# Altium project Gas Analyser O2 CO2.PrjPcb
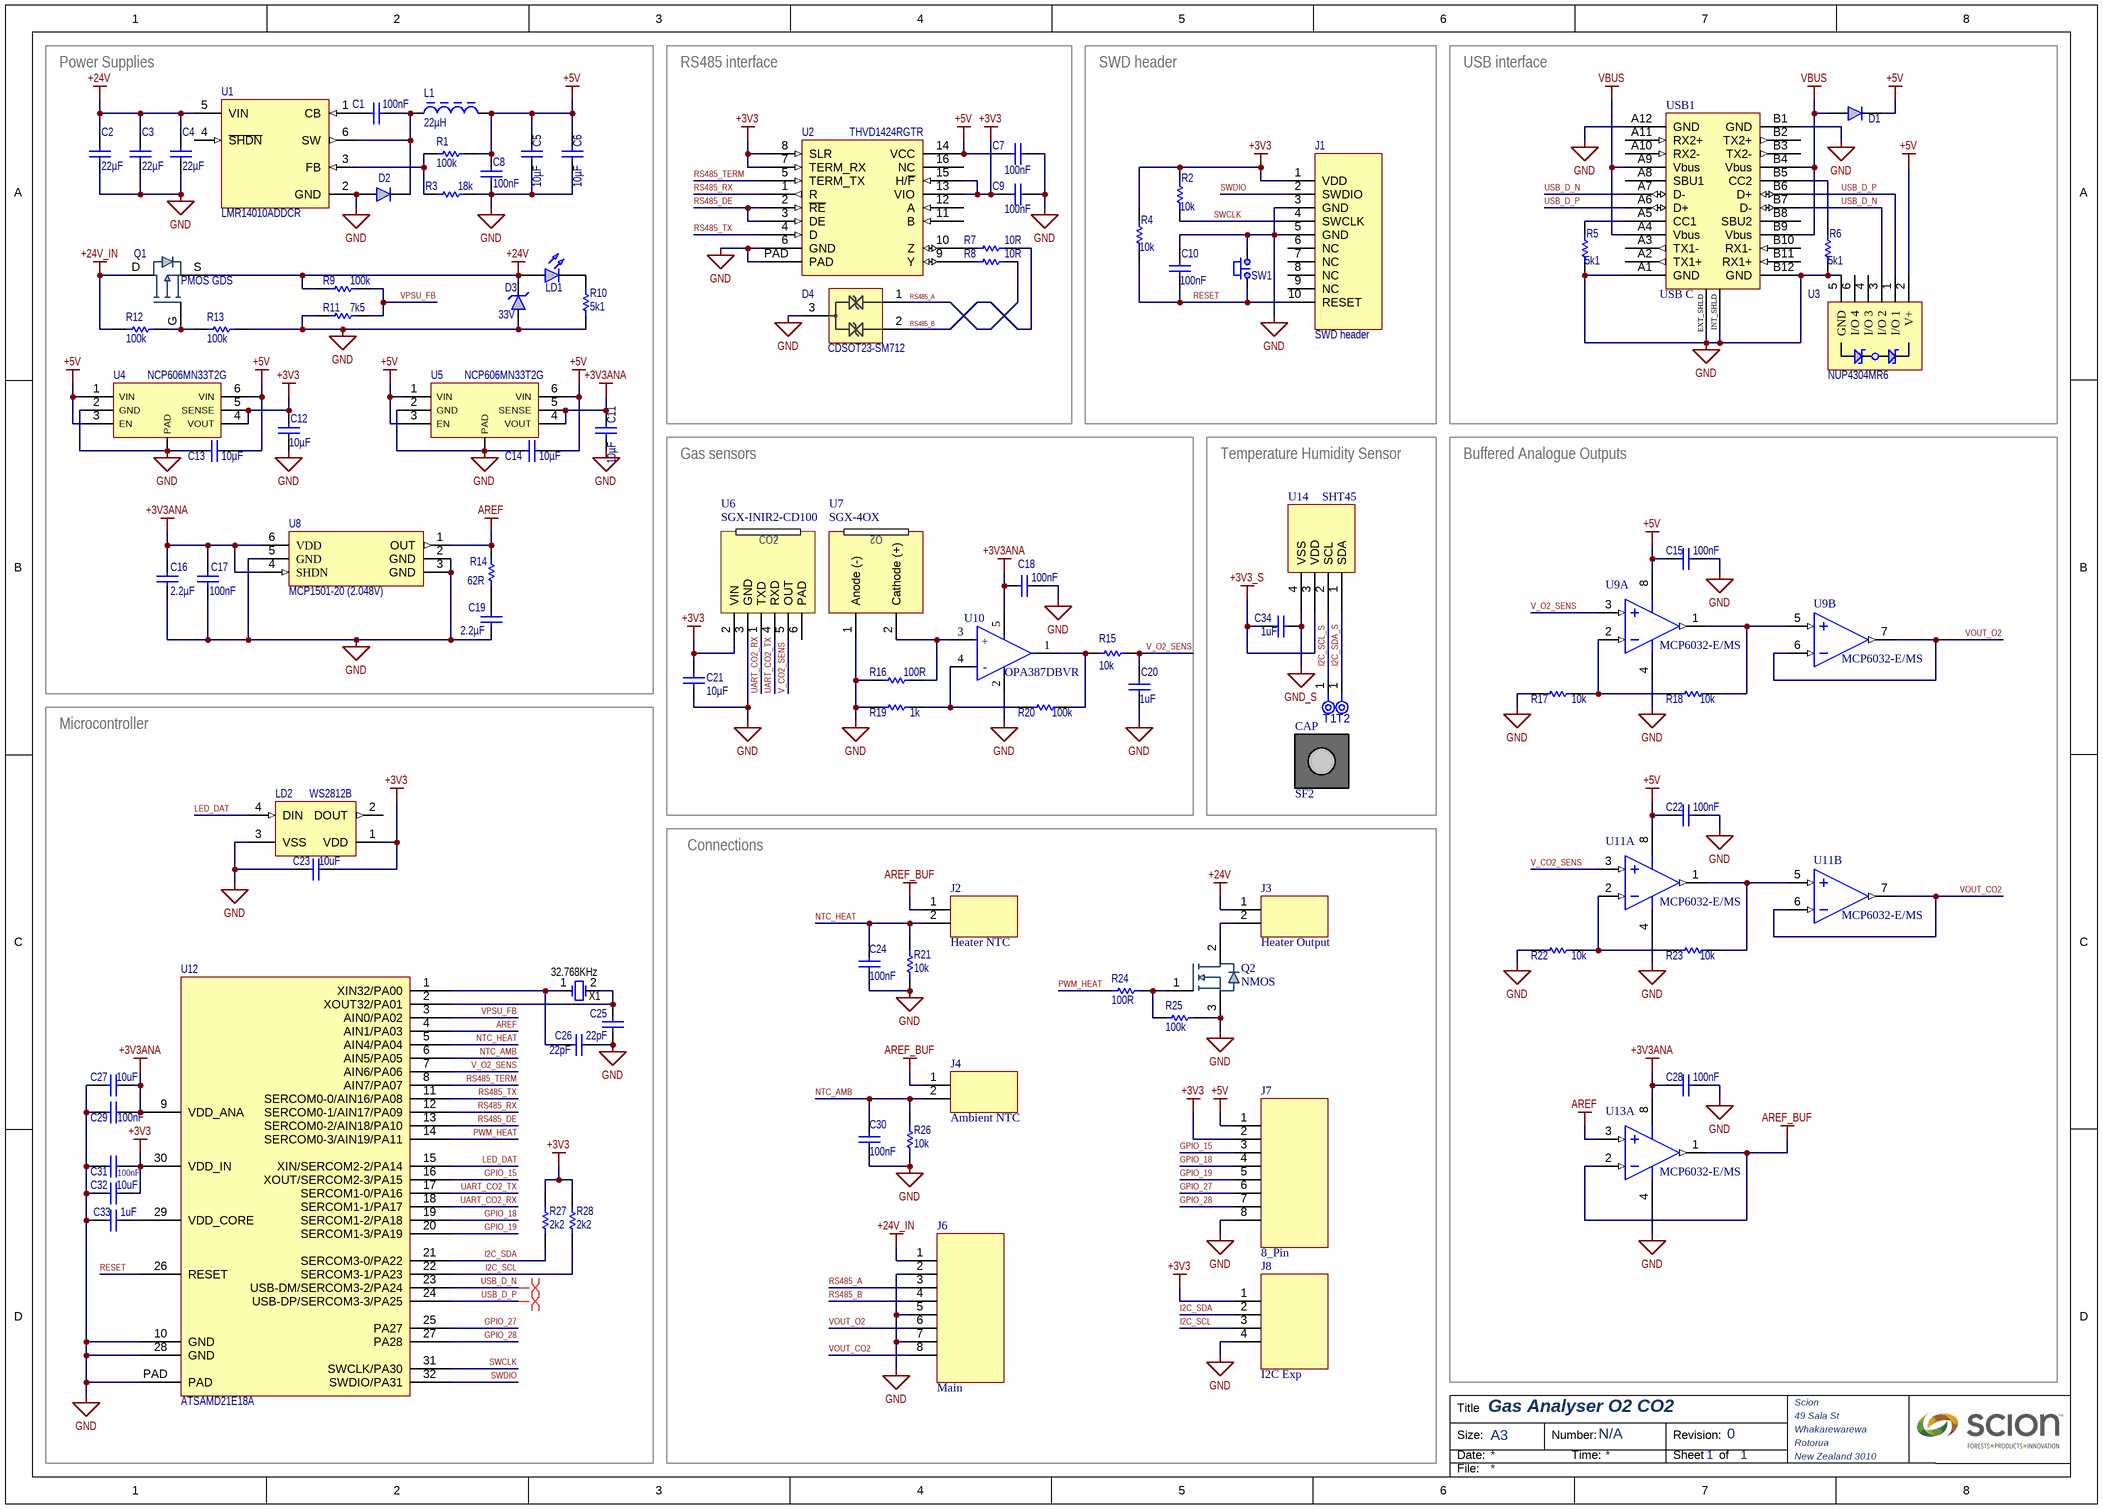
[diagram p0: Gas Analyser O2 CO2.SchDoc]
1 sheet, 98 parts. Net scope: global (net labels, ports and power ports of the same name join across sheets).
Board files: Gas Analyser O2 CO2 - No SHT45 Board.PcbDoc, Gas Analyser O2 CO2.PcbDoc

## Sheet Gas Analyser O2 CO2.SchDoc: Gas Analyser O2 CO2
size A3; Author: Peake J; CompanyName: Scion Research; DrawnBy: Peake J; Engineer: Peake J; Organization: Scion; Address1: 49 Sala St; Address2: Whakarewarewa; Address3: Rotorua; Address4: New Zealand 3010; DocumentNumber: N/A; Revision: 0; SheetNumber: 1; SheetTotal: 1

### Parts
C1  value 100nF  [0603_CAP]  (hidden comment: Capacitor)
C2  value 22µF  [1206_CAP]  (hidden comment: Capacitor)
C3  value 22µF  [1206_CAP]  (hidden comment: Capacitor)
C4  value 22µF  [1206_CAP]  (hidden comment: Capacitor)
C5  value 10µF  [0603_CAP]  (hidden comment: Capacitor)
C6  value 10µF  [0603_CAP]  (hidden comment: Capacitor)
C7  value 100nF  [0603_CAP]  (hidden comment: Capacitor)
C8  value 100nF  [0603_CAP]  (hidden comment: Capacitor)
C9  value 100nF  [0603_CAP]  (hidden comment: Capacitor)
C10  value 100nF  [0603_CAP]  (hidden comment: Capacitor)
C11  value 10µF  [0603_CAP]  (hidden comment: Capacitor)
C12  value 10µF  [0603_CAP]  (hidden comment: Capacitor)
C13  value 10µF  [0603_CAP]  (hidden comment: Capacitor)
C14  value 10µF  [0603_CAP]  (hidden comment: Capacitor)
C15  value 100nF  [0603_CAP]  (hidden comment: Capacitor)
C16  value 2.2µF  [0603_CAP]  (hidden comment: Capacitor)
C17  value 100nF  [0603_CAP]  (hidden comment: Capacitor)
C18  value 100nF  [0603_CAP]  (hidden comment: Capacitor)
C19  value 2.2µF  [0603_CAP]  (hidden comment: Capacitor)
C20  value 1uF  [0603_CAP]  (hidden comment: Capacitor)
C21  value 10µF  [0603_CAP]  (hidden comment: Capacitor)
C22  value 100nF  [0603_CAP]  (hidden comment: Capacitor)
C23  value 10uF  [0603_CAP]  (hidden comment: Capacitor)
C24  value 100nF  [0603_CAP]  (hidden comment: Capacitor)
C25  value 22pF  [0402_CAP]  (hidden comment: Capacitor)
C26  value 22pF  [0402_CAP]  (hidden comment: Capacitor)
C27  value 10uF  [0603_CAP]  (hidden comment: Capacitor)
C28  value 100nF  [0603_CAP]  (hidden comment: Capacitor)
C29  value 100nF  [0402_CAP]  (hidden comment: Capacitor)
C30  value 100nF  [0603_CAP]  (hidden comment: Capacitor)
C31  value 100nF  [0402_CAP]  (hidden comment: Capacitor)
C32  value 10uF  [0603_CAP]  (hidden comment: Capacitor)
C33  value 1uF  [0402_CAP]  (hidden comment: Capacitor)
C34  value 1uF  [0603_CAP]  (hidden comment: Capacitor)
CAP  SF2  [SF2-Footprint-1]
D1  Diode  [SOD-123]  (value not drawn)
D2  Diode  [SOD-123]  (value not drawn)
D3  Rated Voltage: 33V  [SMBJ]  (hidden comment: Transil)
D4  CDSOT23-SM712  [FP-SOT23-IPC_C]
J1  SWD header  [DIP10_1.27_M_SMD]
J2  Heater NTC  [2mm RA S2B-PH-K-S]
J3  Heater Output  [2mm RA S2B-PH-K-S]
J4  Ambient NTC  [2mm RA S2B-PH-K-S]
J6  Main  [8P RA MOLEX Clik-MATE 1.5mm]
J7  8_Pin  [8P DIP Male Header 2.54mm]
J8  I2C Exp  [4P RA MOLEX Clik-MATE 1.5mm]
L1  value 22µH  [BOUR-SRN8040_V]  (hidden comment: Inductor)
LD1  LED  [0805]  (value not drawn)
LD2  WS2812B  [WS2812B-2020]
Q1  PMOS GDS  [PowerDI 5060-8]
Q2  NMOS  [SOT-23]
R1  value 100k  [0603_RES]  (hidden comment: Resistor)
R2  value 10k  [0603_RES]  (hidden comment: Resistor)
R3  value 18k  [0603_RES]  (hidden comment: Resistor)
R4  value 10k  [0603_RES]  (hidden comment: Resistor)
R5  value 5k1  [0603_RES]  (hidden comment: Resistor)
R6  value 5k1  [0603_RES]  (hidden comment: Resistor)
R7  value 10R  [0603_RES]  (hidden comment: Resistor)
R8  value 10R  [0603_RES]  (hidden comment: Resistor)
R9  value 100k  [0603_RES]  (hidden comment: Resistor)
R10  value 5k1  [0603_RES]  (hidden comment: Resistor)
R11  value 7k5  [0603_RES]  (hidden comment: Resistor)
R12  value 100k  [0603_RES]  (hidden comment: Resistor)
R13  value 100k  [0603_RES]  (hidden comment: Resistor)
R14  value 62R  [0603_RES]  (hidden comment: Resistor)
R15  value 10k  [0603_RES]  (hidden comment: Resistor)
R16  value 100R  [0603_RES]  (hidden comment: Resistor)
R17  value 10k  [0603_RES]  (hidden comment: Resistor)
R18  value 10k  [0603_RES]  (hidden comment: Resistor)
R19  value 1k  [0603_RES]  (hidden comment: Resistor)
R20  value 100k  [0603_RES]  (hidden comment: Resistor)
R21  value 10k  [0603_RES]  (hidden comment: Resistor)
R22  value 10k  [0603_RES]  (hidden comment: Resistor)
R23  value 10k  [0603_RES]  (hidden comment: Resistor)
R24  value 100R  [0603_RES]  (hidden comment: Resistor)
R25  value 100k  [0603_RES]  (hidden comment: Resistor)
R26  value 10k  [0603_RES]  (hidden comment: Resistor)
R27  value 2k2  [0603_RES]  (hidden comment: Resistor)
R28  value 2k2  [0603_RES]  (hidden comment: Resistor)
SW1  EVP-AAN02Q  [FP-EVP-AAN02Q-MFG]  (value not drawn)
T1  Test Point  [TP06R]  (value not drawn)  (no BOM)
T2  Test Point  [TP06R]  (value not drawn)  (no BOM)
U1  LMR14010ADDCR  [FP-DDC0006A-IPC_A]
U2  THVD1424RGTR  [QFN50P300X300X100_HS-17N]
U3  NUP4304MR6  [TSOP-6]
U4  NCP606MN33T2G  [QFN95P330X295X100_HS-7N]
U5  NCP606MN33T2G  [QFN95P330X295X100_HS-7N]
U6  SGX-INIR2-CD100  [SGX-INIR2-CD100-Footprint-1]
U7  SGX-4OX  [SGX-4OX-Footprint-1]
U8  MCP1501-20 (2.048V)  [SOT-6]
U9  MCP6032-E/MS  [MSOP-MS8_M]  (parts A,B of 2)
U10  OPA387DBVR  [FP-DBV0005A-IPC_A]
U11  MCP6032-E/MS  [MSOP-MS8_M]  (parts A,B of 2)
U12  ATSAMD21E18A  [32P QFN]
U13  MCP6032-E/MS  [MSOP-MS8_M]  (part A of 2)
U14  SHT45  [SHT45-AD1B-R3-Footprint-1]
USB1  USB C  [GT-USB-7010ASV]
X1  32.768KHz  [ABRA-ABS07-2_V]

### Blocks framed on the sheet
Power Supplies: C1-C6 C8 C11-C14 C16 C17 C19 D2 D3 L1 LD1 Q1 R1 R3 R9-R14 U1 U4 U5 U8
RS485 interface: C7 C9 D4 R7 R8 U2
SWD header: C10 J1 R2 R4 SW1
USB interface: D1 R5 R6 U3 USB1
Gas sensors: C18 C20 C21 R15 R16 R19 R20 U6 U7 U10
Temperature Humidity Sensor: C34 CAP T1 T2 U14
Buffered Analogue Outputs: C15 C22 C28 R17 R18 R22 R23 U9 U11 U13
Microcontroller: C23 C25-C27 C29 C31-C33 LD2 R27 R28 U12 X1
Connections: C24 C30 J2-J4 J6-J8 Q2 R21 R24-R26

### Nets
+3V3: C9.2 C12.1 C21.1 C23.1 C31.1 C32.1 J1.1(VDD) J7.2 J8.1 LD2.1(VDD) R2.1 R4.1 R27.2 R28.2 U2.7(TERM_RX) U2.8(SLR) U2.13(VIO) U2.15(H/~{F}) U4.4(VOUT) U4.5(SENSE) U6.2(VIN) U12.30(VDD_IN)
+3V3_S: C34.2 U14.3(VDD)
+3V3ANA: C11.1 C16.1 C17.1 C18.1 C27.1 C28.1 C29.1 U5.4(VOUT) U5.5(SENSE) U8.4(SHDN) U8.6(VDD) U10.5(V+) U12.9(VDD_ANA) U13.8(V+)
+5V: C5.1 C6.1 C7.2 C8.1 C13.1 C14.1 C15.1 C22.1 D1.1(K) J7.1 L1.2 R1.2 U2.14(VCC) U3.2(V+) U4.1(VIN) U4.3(EN) U4.6(VIN) U5.1(VIN) U5.3(EN) U5.6(VIN) U9.8(V+) U11.8(V+)
+24V: C2.1 C3.1 C4.1 D3.2(K) J3.1(+) LD1.2(A) Q1.S R9.1 U1.5(VIN)
+24V_IN: J6.1 Q1.D R12.1
AREF: R14.1 U8.1(OUT) U12.4(AIN1/PA03) U13.3(VINA+)
AREF_BUF: J2.1(+) J4.1(+) U13.1(VOUTA) U13.2(VINA-)
GND: C2.2 C3.2 C4.2 C5.2 C6.2 C7.1 C8.2 C9.1 C10.1 C11.2 C12.2 C13.2 C14.2 C15.2 C16.2 C17.2 C18.2 C19.1 C20.2 C21.2 C22.2 C23.2 C24.1 C25.2 C26.1 C27.2 C28.2 C29.2 C30.1 C31.2 C32.2 C33.2 D2.2(A) D3.1(A) D4.3 J1.3(GND) J1.5(GND) J6.2 J6.5 J6.7 J7.8 J8.4 LD2.3(VSS) Q2.3(S) R3.2 R5.2 R6.2 R10.2 R11.1 R13.2 R16.1 R17.2 R19.2 R21.1 R22.2 R25.1 R26.1 SW1.2 U1.2(GND) U2.6(GND) U2.PAD U3.5(GND) U4.2(GND) U4.PAD U5.2(GND) U5.PAD U6.3(GND) U7.1(Anode_(-)) U8.2(GND) U8.3(GND) U8.5(GND) U9.4(V-) U10.2(V-) U11.4(V-) U12.10(GND) U12.28(GND) U12.PAD U13.4(V-) USB1.A1(GND) USB1.A12(GND) USB1.B1(GND) USB1.B12(GND) USB1.EXT_SHLD USB1.INT_SHLD
GND_S: C34.1 U14.4(VSS)
VBUS: D1.2(A) USB1.A4(Vbus) USB1.A9(Vbus) USB1.B4(Vbus) USB1.B9(Vbus)
GPIO_15: J7.3 U12.16(XOUT/SERCOM2-3/PA15)
GPIO_18: J7.4 U12.19(SERCOM1-2/PA18)
GPIO_19: J7.5 U12.20(SERCOM1-3/PA19)
GPIO_27: J7.6 U12.25(PA27)
GPIO_28: J7.7 U12.27(PA28)
I2C_SCL: J8.3 R28.1 U12.22(SERCOM3-1/PA23)
I2C_SCL_S: T1.1(TP) U14.2(SCL)
I2C_SDA: J8.2 R27.1 U12.21(SERCOM3-0/PA22)
I2C_SDA_S: T2.1(TP) U14.1(SDA)
LED_DAT: LD2.4(DIN) U12.15(XIN/SERCOM2-2/PA14)
NTC_AMB: C30.2 J4.2(-) R26.2 U12.6(AIN5/PA05)
NTC_HEAT: C24.2 J2.2(-) R21.2 U12.5(AIN4/PA04)
PWM_HEAT: R24.2 U12.14(SERCOM0-3/AIN19/PA11)
RESET: C10.2 J1.10(RESET) R4.2 SW1.1 U12.26(RESET)
RS485_A: D4.1 J6.3 R8.1
RS485_B: D4.2 J6.4 R7.2
RS485_DE: U2.2(~{RE}) U2.3(DE) U12.13(SERCOM0-2/AIN18/PA10)
RS485_RX: U2.1(R) U12.12(SERCOM0-1/AIN17/PA09)
RS485_TERM: U2.5(TERM_TX) U12.8(AIN7/PA07)
RS485_TX: U2.4(D) U12.11(SERCOM0-0/AIN16/PA08)
SWCLK: J1.4(SWCLK) R2.2 U12.31(SWCLK/PA30)
SWDIO: J1.2(SWDIO) U12.32(SWDIO/PA31)
UART_CO2_RX: U6.1(TXD) U12.18(SERCOM1-1/PA17)
UART_CO2_TX: U6.4(RXD) U12.17(SERCOM1-0/PA16)
USB_D_N: U3.3(I/O_2) U12.23(USB-DM/SERCOM3-2/PA24) USB1.A7(D-) USB1.B7(D-)
USB_D_P: U3.1(I/O_1) U12.24(USB-DP/SERCOM3-3/PA25) USB1.A6(D+) USB1.B6(D+)
V_CO2_SENS: U6.5(OUT) U11.3(VINA+)
V_O2_SENS: C20.1 R15.2 U9.3(VINA+) U12.7(AIN6/PA06)
VOUT_CO2: J6.8 U11.6(VINB-) U11.7(VOUTB)
VOUT_O2: J6.6 U9.6(VINB-) U9.7(VOUTB)
VPSU_FB: R9.2 R11.2 U12.3(AIN0/PA02)
NetC1_1: C1.1 D2.1(K) L1.1 U1.6(SW)
NetC1_2: C1.2 U1.1(CB)
NetC19_2: C19.2 R14.2
NetC25_1: C25.1 U12.2(XOUT32/PA01) X1.2(OSC2)
NetC26_2: C26.2 U12.1(XIN32/PA00) X1.1(OSC1)
NetC33_1: C33.1 U12.29(VDD_CORE)
NetJ3_2: J3.2(-) Q2.2(D)
NetLD1_1: LD1.1(K) R10.1
NetQ1_G: Q1.G R12.2 R13.1
NetQ2_1: Q2.1(G) R24.1 R25.2
NetR1_1: R1.1 R3.1 U1.3(FB)
NetR5_1: R5.1 USB1.A5(CC1)
NetR6_1: R6.1 USB1.B5(CC2)
NetR7_1: R7.1 U2.10(Z)
NetR8_2: R8.2 U2.9(Y)
NetR15_1: R15.1 R20.2 U10.1(OUT)
NetR16_2: R16.2 U7.2(Cathode_(+)) U10.3(+IN)
NetR17_1: R17.1 R18.1 U9.2(VINA-)
NetR18_2: R18.2 U9.1(VOUTA) U9.5(VINB+)
NetR19_1: R19.1 R20.1 U10.4(-IN)
NetR22_1: R22.1 R23.1 U11.2(VINA-)
NetR23_2: R23.2 U11.1(VOUTA) U11.5(VINB+)

Not connected (* = marked no-connect by the designer): J1 6(NC) 7(NC) 8(NC) 9(NC); LD2 2(DOUT); U1 4(~{SHDN}); U2 11(B) 12(A) 16(NC); U3 4(I/O_3) 6(I/O_4); U6 6(PAD); USB1 A2(TX1+) A3(TX1-) A8(SBU1) A10(RX2-) A11(RX2+) B2(TX2+) B3(TX2-) B8(SBU2) B10(RX1-) B11(RX1+)

### Layout directives
differential pair: USB_D_N, USB_D_P

### Notes on the sheet
- Title
- Size:
- Date:
- A3
- Number:
- Time:
- Revision:
- Sheet
- of
- File:
- (in symbol CMP-010-00003-2) O2
- (in symbol CMP-010-00004-2) CO2
- (in symbol CMP-014-00004-1) +; -

### Library data of the parts
C1-C34 = CMP-001-00172-2: SMD Capacitor; Pins: 2; Source: Discrete.SchLib; Design Item ID: Capacitor; Component Type: Standard
CAP = CMP-010-00005-1: Sensirion SHT cap for SHT4x sensors
D1 D2 = CMP-004-00083-4: SMD Diode; Design Item ID: Diode; Pins: 2; Source: Discrete.SchLib; Component Type: Standard; Pin Count: 2
D3 = CMP-079-000108-2: Transient Voltage Suppressor; MFN: SMBJ33A; Component Type: Standard; Pin Count: 2; Source: Discrete.SchLib; Breakdown Voltage: *; Design Item ID: Transil; Clamping Voltage: *
D4 = CDSOT23-SM712-3: Trans Voltage Suppressor Diode, 400W, 7V V(RWM), Bidirectional, 2 Element, Silicon; Number of Elements: 2; Min Breakdown Voltage: 7.5V; Qualification Status: Not Qualified; Clamping Voltage-Max: 19V; Reference Standard: IEC-61000-4-2; Package Body Material: Plastic; Technology: AVALANCHE; JESD-30 Code: R-PDSO-G3; Moisture Sensitivity Level: 1; Polarity: Bidirectional; Diode Element Material: SILICON; Rep Pk Reverse Voltage-Max: 7V; JESD-609 Code: e3; Non-rep Peak Rev Power Dis-Max: 400W; Diode Type: TRANS VOLTAGE SUPPRESSOR; Package Style: SMALL OUTLINEMeter; Pins: 3; Surface Mount: Yes; Breakdown Voltage-Nom: 7.5V; Reach SVHC Compliant: Yes; Package Shape: Rectangular; Terminal Form: Gull Wing; RoHS Compliant: Yes; Terminal Position: DUAL; Terminal Finish: Tin
J1 = CMP-002-00170-1: 10 Pin Connector; Component Type: Standard; Pins: 10; Source: Connectors.SchLib; Pin Count: 10; Design Item ID: 10_Pin
J2-J4 = CMP-002-00173-4: 2 Pin Connector; Pin Count: 2; Source: Connectors.SchLib; Pins: 2; Component Type: Standard; Design Item ID: 2_Pin; MFN: *
J6 = CMP-002-00183-3: 8 Pin Connector; Source: Connectors.SchLib; Design Item ID: 8_Pin; Component Type: Standard; Pins: 8; Pin Count: 8
J7 = CMP-002-00183-4: 8 Pin Connector; Source: Connectors.SchLib; Design Item ID: 8_Pin; Component Type: Standard; Pins: 8; Pin Count: 8
J8 = CMP-002-00177-3: 4 Pin Connector; Component Type: Standard; Pin Count: 4; Pins: 4; Source: Connectors.SchLib; Design Item ID: 4_Pin
L1 = CMP-006-00052-2: Power Inductor; DCR: 100mR; Current Rating: 2.2A; Pins: 2; Component Type: Standard; Design Item ID: Inductor; Source: Discrete.SchLib; Pin Count: 2; MFN: *
LD1 = CMP-004-00084-3: SMD LED; Colour: RED; Pins: 2; Source: Discrete.SchLib; Design Item ID: LED; Component Type: Standard; Pin Count: 2
LD2 = CMP-079-000113-2: Intelligent Control LED Integrated Light Source, 3.5 to 5.3 V, -25 to 80 degC, 4-Pin SMD, RoHS, Bulk; Manufacturer: Adafruit Industries; Mounting Technology: SM; RoHS Compliant: False; Package Reference: WS2812B; Case/Package: WS2812B; Component Type: Standard; Manufacturer URL: https://www.adafruit.com/; Package Description: 4-Pin Surface Mount Device, Body 5 x 5 mm, Pitch 3.3 mm; Source: All Components - 30.06.23 - 18.27.SchLib; Datasheet Version: May-13; Datasheet URL: https://cdn-shop.adafruit.com/datasheets/WS2812B.pdf; Pin Count: 4; Design Item ID: CMP-007-00035-3
Q1 = CMP-079-000102-2: P Channel MOSFET; MFN: *; Design Item ID: PMOS GDS; VGS Max: *; Continuous Current: *; VDS Breakdown: *; Source: P-MOS.SchLib; Component Type: Standard; Pin Count: 3
Q2 = CMP-079-000093-2: N Channel MOSFET; Design Item ID: NMOS; Source: N-MOS.SchLib; MFN: *; Pin Count: 3; Component Type: Standard
R1-R4 R7-R17 R19-R22 R24-R28 = CMP-009-00356-1: SMD Resistor; Pins: 2; Source: Discrete.SchLib; Component Type: Standard; Design Item ID: Resistor
R5 R6 = CMP-009-00356-1: SMD Resistor; Value: 5k1; Pins: 2; Source: Discrete.SchLib; Component Type: Standard; Design Item ID: Resistor
R18 R23 = CMP-009-00356-1: SMD Resistor; Value: 10k; Pins: 2; Source: Discrete.SchLib; Component Type: Standard; Design Item ID: Resistor
SW1 = CMP-011-00000-2: Switch Tactile N.O. SPST Rectangular Button J-Bend 0.02A 15VDC 100000Cycles 5N SMD T/R
T1 T2 = CMP-076-000000-3: 0.6mm round; Component Type: Standard (No BOM); Pin Count: 1; Source: All Components - 30.06.23 - 18.27.SchLib; Design Item ID: CMP-00028-00002-1; Pins: 1
U1 = CMP-079-000005-5: 7-40VDC-DC buck converter; Number of Outputs: 1; Max Output Voltage: 40V; Output Current: 1A; Min Input Voltage: 4V; Output Type: Adjustable; Synchronous Rectifier: No; Min Output Voltage: 765mV; Output Configuration: Positive; Switching Frequency: 850kHz; Max Operating Temperature: 125°C; Case/Package: SOT-23-6; Features: UVLO; Pin Count: 6; Packaging: Cut Tape; Mount: Surface Mount; Component Type: Standard; Min Operating Temperature: -40°C; Max Input Voltage: 40V; Source: All Components - 30.06.23 - 18.27.SchLib; Design Item ID: CMP-00007-1
U2 = CMP-015-00000-3: RS-485 transceiver with slew rate control, integrated switchable termination and duplex switching 16-VQFN -40 to 125
U3 = CMP-079-000096-2: ESD Protection Doide Array; Design Item ID: NUP4304MR6; Pin Count: 6; Component Type: Standard; Source: ON Semi.SchLib
U4 U5 = CMP-019-00001-1: Fixed Positive LDO Regulator, 3.3V, 0.22V Dropout, CMOS; Max Supply Voltage: 6V; RoHS Compliant: Yes; Case/Package: HVSON; Pins: 6
U6 = CMP-010-00004-2: SGX Sensortech IR CO2 Sensor Module
U7 = CMP-010-00003-2: SGX Sensortech Electrochemical O2 Sensor Module
U8 = CMP-079-000089-1: Voltage Reference; Pin Count: 6; Source: Microchip.SchLib; Component Type: Standard; Design Item ID: MCP1501
U9 U11 U13 = CMP-014-00005-3: Op Amp Dual Precision Amplifier R-R I/O 5.5V Automotive 8-Pin MSOP Tube; Min Supply Voltage: 1.8V; Pins: 8; Max Operating Temperature: 125°C; Max Supply Voltage: 5.5V; Min Operating Temperature: -40°C; Mounting Technology: Surface Mount; Case/Package: MSOP
U10 = CMP-014-00004-1: Ultra-high precision (2 µV), zero-drift (0.003 µV/C), low-input-bias-current op amp (single) 5-SOT-23 -40 to 125; Min Supply Voltage: 1.7V; Max Supply Voltage: 5.5V; Pins: 5; Min Operating Temperature: -40°C; Max Operating Temperature: 125°C; Case/Package: SOT-23
U12 = CMP-079-000006-3: ATMEL         ATSAMD21E17A-MU            32 Bit Microcontroller, SAM D Series, ARM Cortex-M0+, 48 MHz, 128 KB, 16 KB, 32 Pins, QFN; Data Bus Width: 32b; RAM Size: 16KB; Number of I/Os: 26; Number of Timers/Counters: 6; Max Frequency: 48MHz; Memory Size: 128KB; Watchdog Timer: Yes; Min Supply Voltage: 1.62V; Operating Supply Voltage: 3.3V; Peripherals: Brown-out Detect/Reset,POR,PWM,WDT,DMA; Memory Type: FLASH; Max Supply Voltage: 3.63V; Interface: I2C,SPI,UART,USART,LIN,USB,I2S; Oscillator Type: Internal; Speed: 48RPM; Clock Frequency: 32MHz; Packaging: Tray; Max Operating Temperature: 85°C; Number of Programmable I/O: 26; Min Operating Temperature: -40°C; RoHS Compliant: Yes; Frequency: 48MHz; Core Architecture: ARM; Mount: Surface Mount; Lead Free: Lead Free; Number of Pins: 32; REACH SVHC: No SVHC; Contact Plating: Tin,Matte; Case/Package: QFN; Pin Count: 33; Design Item ID: CMP-00013-1; Component Type: Standard; Source: All Components - 30.06.23 - 18.27.SchLib; Nominal Supply Voltage: 3.3V; Terminal Pitch: 0.5mm; Number of I/O Lines: 26; Package Style: CHIP CARRIER, HEAT SINK/SLUG, VERY THIN PROFILEMeter; Terminal Form: No Lead; Height - Seated (Max): 1mm; Technology: CMOS; JESD-30 Code: S-XQCC-N32; Pins: 32; Terminal Position: QUAD; Width: 5mm; Surface Mount: Yes; Temperature Grade: AUTOMOTIVE; Length: 5mm; Package Shape: Square
U14 = CMP-079-000038-2: Board Mount Humidity Sensors Ultra-High Accuracy Digital Humidity & Temperature Sensor with 1.0%RH and 0.1C tolerances and 1.08 ... 3.6 V supply voltage. Integrated high-power heater, on-chip protection options availabel, NIST tracable.; Component Type: Standard; Design Item ID: CMP-00047-1; Source: All Components - 30.06.23 - 18.27.SchLib; Pin Count: 4
USB1 = CMP-079-000004-4: Vertical or RA Type C Usb Connector Rohs Compliant: Yes; Pin Count: 26; Design Item ID: CMP-00005-5; Source: All Components - 30.06.23 - 18.27.SchLib; Component Type: Standard
X1 = CMP-003-00061-3: Low Profile Crystal, 32.768 kHz, +/- 20 ppm, 12.5 pF, -40 to 85 degC, 2-Pin SMD, Pb-Free, Tape and Reel; Manufacturer: Abracon; Tolerance: 20ppm; Load Capacitance: 12.5pF; ESR: 70k; Case/Package: CSMD; Datasheet Version: Aug-15; Pins: 2; Max Operating Temperature: 85°C; Package Description: 2-Pin Surface Mount Device, Body 3.2 x 1.5 mm; Manufacturer URL: http://www.abracon.com/; Package URL: http://www.abracon.com/Support/PackageDrawing/Resonators/ABS07.PDF; Min Operating Temperature: -40°C; Packaging: TapeandReel; RoHS Compliant: True; Package Reference: ABS07-2; Frequency Tolerance: 20ppm; Frequency: 32.768kHz; Datasheet URL: http://www.abracon.com/Resonators/ABS07.pdf; Package Quantity: 3000; Mounting Technology: SM; Component Type: Standard; Source: All Components - 30.06.23 - 18.27.SchLib; Design Item ID: CMP-003-00022-1